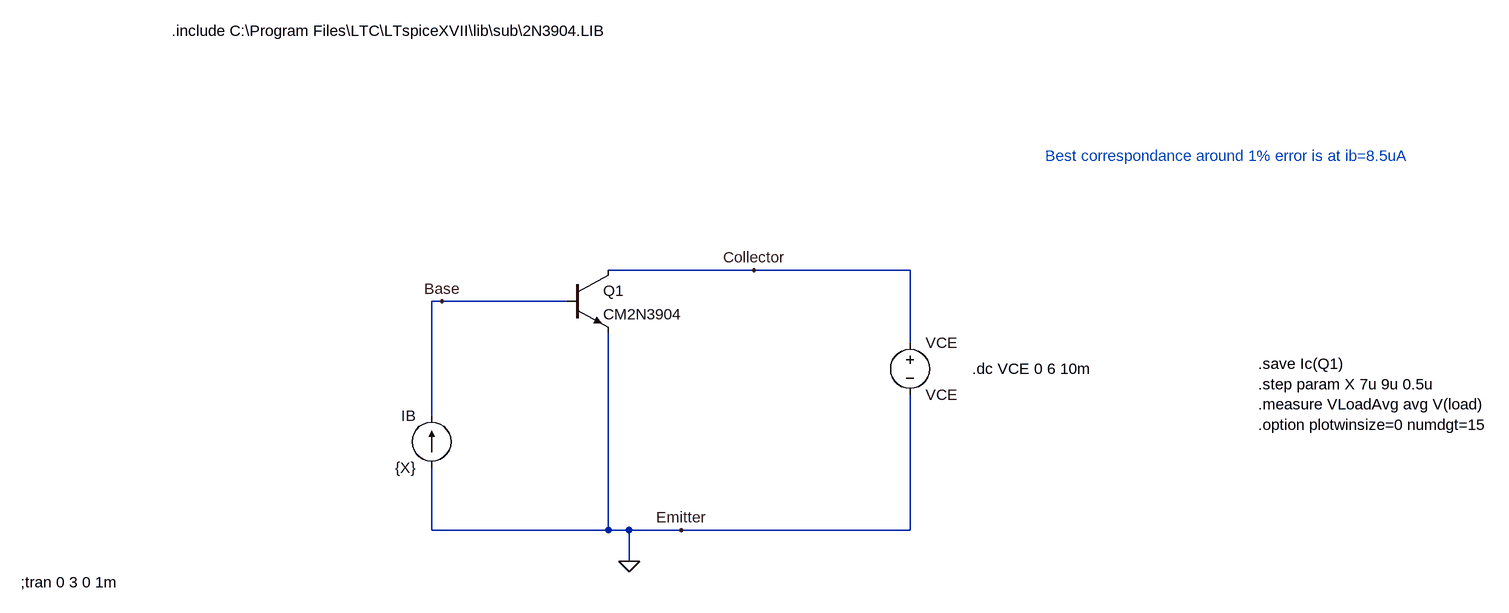
[diagram p0: schematic mp2 task 1B ii) 2N3904 profiling.asc]
mp2 task 1B ii) 2N3904 profiling.asc, the LTspice schematic file:
Version 4
SHEET 1 2624 912
WIRE 1072 400 848 400
WIRE 1312 400 1072 400
WIRE 592 448 576 448
WIRE 784 448 592 448
WIRE 1312 512 1312 400
WIRE 576 624 576 448
WIRE 576 800 576 704
WIRE 848 800 848 496
WIRE 848 800 576 800
WIRE 880 800 848 800
WIRE 960 800 880 800
WIRE 1312 800 1312 592
WIRE 1312 800 960 800
WIRE 880 848 880 800
FLAG 592 448 Base
FLAG 1072 400 Collector
FLAG 960 800 Emitter
FLAG 880 848 0
SYMBOL voltage 1312 496 R0
WINDOW 123 0 0 Left 0
WINDOW 39 0 0 Left 0
SYMATTR InstName VCE
SYMATTR Value VCE
SYMBOL npn 784 400 R0
SYMATTR InstName Q1
SYMATTR Value CM2N3904
SYMBOL current 576 704 R180
WINDOW 0 24 80 Left 2
WINDOW 3 24 0 Left 2
WINDOW 123 0 0 Left 0
WINDOW 39 0 0 Left 0
SYMATTR InstName IB
SYMATTR Value {X}
TEXT -56 880 Left 2 !;tran 0 3 0 1m
TEXT 176 32 Left 2 !.include C:\\Program Files\\LTC\\LTspiceXVII\\lib\\sub\\2N3904.LIB
TEXT 1408 552 Left 2 !.dc VCE 0 6 10m
TEXT 1848 544 Left 2 !.save Ic(Q1)\n.step param X 7u 9u 0.5u\n.measure VLoadAvg avg V(load)\n.option plotwinsize=0 numdgt=15
TEXT 1520 224 Left 2 ;Best correspondance around 1% error is at ib=8.5uA

The netlist it stands for:
* mp2 task 1B ii) 2N3904 profiling.asc
VCE Collector 0 VCE
Q1 Collector Base 0 0 CM2N3904
IB 0 Base {X}
.model NPN NPN
.model PNP PNP
.lib standard.bjt
;tran 0 3 0 1m
.include C:\Program Files\LTC\LTspiceXVII\lib\sub\2N3904.LIB
.dc VCE 0 6 10m
.save Ic(Q1)
.step param X 7u 9u 0.5u
.measure VLoadAvg avg V(load)
.option plotwinsize=0 numdgt=15
* Best correspondance around 1% error is at ib=8.5uA
.backanno
.end